# Altium project DVT-SPI_Buffer.PrjPcb (part 2 of 2)
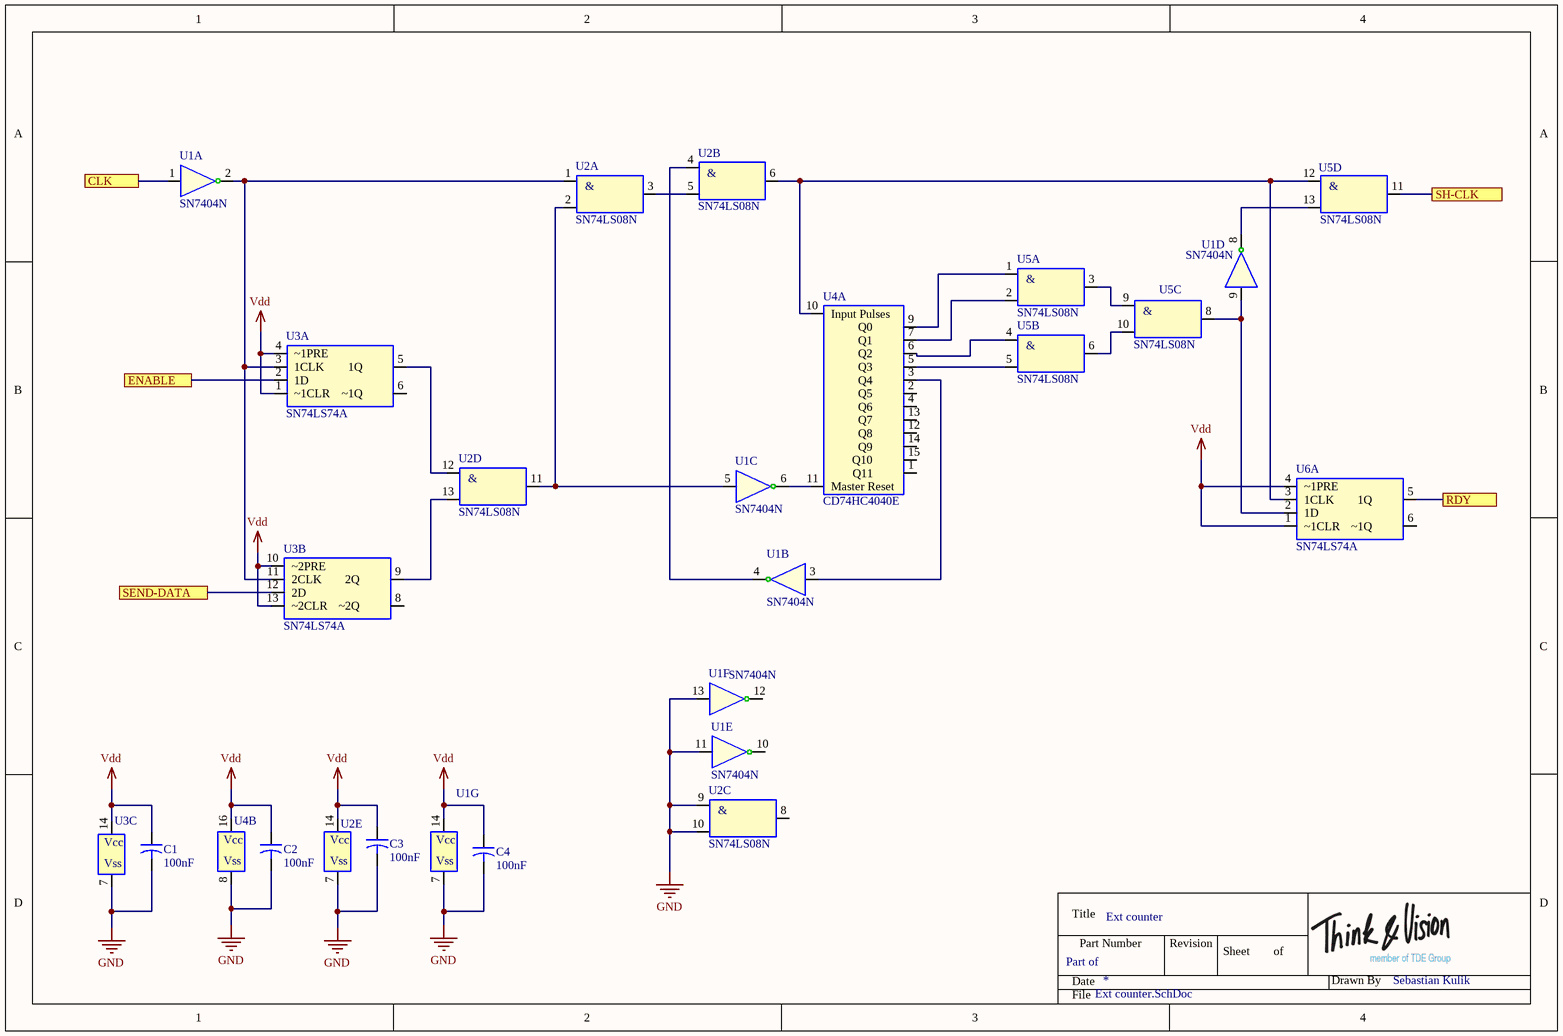
[diagram p7: Ext counter.SchDoc]

## Nets that join several sheets
GND: SPI Counter (7 pins), J-K-Flip-Flop (21 pins), Universal register 16bit/Universal Register 4Bit (U1_Universal_register_16bit_Universal_Register_4Bit#1.7 U2_Universal_register_16bit_Universal_Register_4Bit#1.7), Universal register 16bit/Universal Register 4Bit/Quad 2x1 mux (8 pins), Universal register 16bit/Quad 2x1 mux (8 pins), Universal register 16bit/Universal Register 4Bit (U1_Universal_register_16bit_Universal_Register_4Bit#2.7 U2_Universal_register_16bit_Universal_Register_4Bit#2.7), Universal register 16bit/Universal Register 4Bit/Quad 2x1 mux (8 pins), Universal register 16bit/Universal Register 4Bit (U1_Universal_register_16bit_Universal_Register_4Bit#3.7 U2_Universal_register_16bit_Universal_Register_4Bit#3.7), Universal register 16bit/Universal Register 4Bit/Quad 2x1 mux (8 pins), Universal register 16bit/Universal Register 4Bit (U1_Universal_register_16bit_Universal_Register_4Bit#4.7 U2_Universal_register_16bit_Universal_Register_4Bit#4.7), Universal register 16bit/Universal Register 4Bit/Quad 2x1 mux (8 pins), Ext counter (12 pins), Universal register 16bit/Universal Register 4Bit (U1_Universal_register_16bit_Universal_Register_4Bit#5.7 U2_Universal_register_16bit_Universal_Register_4Bit#5.7), Universal register 16bit/Universal Register 4Bit/Quad 2x1 mux (8 pins), Universal register 16bit/Quad 2x1 mux (8 pins), Universal register 16bit/Universal Register 4Bit (U1_Universal_register_16bit_Universal_Register_4Bit#6.7 U2_Universal_register_16bit_Universal_Register_4Bit#6.7), Universal register 16bit/Universal Register 4Bit/Quad 2x1 mux (8 pins), Universal register 16bit/Universal Register 4Bit (U1_Universal_register_16bit_Universal_Register_4Bit#7.7 U2_Universal_register_16bit_Universal_Register_4Bit#7.7), Universal register 16bit/Universal Register 4Bit/Quad 2x1 mux (8 pins), Universal register 16bit/Universal Register 4Bit (U1_Universal_register_16bit_Universal_Register_4Bit#8.7 U2_Universal_register_16bit_Universal_Register_4Bit#8.7), Universal register 16bit/Universal Register 4Bit/Quad 2x1 mux (8 pins)
Vdd: SPI Counter (11 pins), J-K-Flip-Flop (11 pins), Universal register 16bit/Universal Register 4Bit (10 pins), Universal register 16bit/Universal Register 4Bit/Quad 2x1 mux (16 pins), Universal register 16bit/Quad 2x1 mux (16 pins), Universal register 16bit/Universal Register 4Bit (10 pins), Universal register 16bit/Universal Register 4Bit/Quad 2x1 mux (16 pins), Universal register 16bit/Universal Register 4Bit (10 pins), Universal register 16bit/Universal Register 4Bit/Quad 2x1 mux (16 pins), Universal register 16bit/Universal Register 4Bit (10 pins), Universal register 16bit/Universal Register 4Bit/Quad 2x1 mux (16 pins), Ext counter (14 pins), Universal register 16bit/Universal Register 4Bit (10 pins), Universal register 16bit/Universal Register 4Bit/Quad 2x1 mux (8 pins), Universal register 16bit/Quad 2x1 mux (8 pins), Universal register 16bit/Universal Register 4Bit (10 pins), Universal register 16bit/Universal Register 4Bit/Quad 2x1 mux (8 pins), Universal register 16bit/Universal Register 4Bit (10 pins), Universal register 16bit/Universal Register 4Bit/Quad 2x1 mux (8 pins), Universal register 16bit/Universal Register 4Bit (10 pins), Universal register 16bit/Universal Register 4Bit/Quad 2x1 mux (8 pins)
NetCLK-DELAY_1: SPI Counter (U1#2.2), J-K-Flip-Flop (CLK-DELAY.1 U1#3.1)
NetU1#1_3: DVT SPI buffer (U1#1.3), SPI Counter (U6#1.12)
NetU1#2_5: DVT SPI buffer (U2#1.1), SPI Counter (U1#2.5 U3#2.1)
NetU1#2_11: SPI Counter (U1#2.11 U5#1.3 U6#1.6), Universal register 16bit/Quad 2x1 mux (U2_Universal_register_16bit_Quad_2x1_mux#2.5)
NetU1#3_11: SPI Counter (U5#1.5 U7.2), J-K-Flip-Flop (U1#3.11)
NetU1_Universal_register_16bit_Quad_2x1_mux#2_1: SPI Counter (U6#1.5), J-K-Flip-Flop (U2#3.10 U3#3.5), Universal register 16bit/Universal Register 4Bit/Quad 2x1 mux (8 pins), Universal register 16bit/Quad 2x1 mux (8 pins), Universal register 16bit/Universal Register 4Bit/Quad 2x1 mux (8 pins), Universal register 16bit/Universal Register 4Bit/Quad 2x1 mux (8 pins), Universal register 16bit/Universal Register 4Bit/Quad 2x1 mux (8 pins)
NetU1_Universal_register_16bit_Universal_Register_4Bit#1_2: Universal register 16bit/Universal Register 4Bit (U1_Universal_register_16bit_Universal_Register_4Bit#1.2), Universal register 16bit/Universal Register 4Bit/Quad 2x1 mux (U4_Universal_register_16bit_Universal_Register_4Bit_Quad_2x1_mux#1.3)
NetU1_Universal_register_16bit_Universal_Register_4Bit#1_3: Universal register 16bit/Universal Register 4Bit (U1_Universal_register_16bit_Universal_Register_4Bit#1.3 U1_Universal_register_16bit_Universal_Register_4Bit#1.11 U2_Universal_register_16bit_Universal_Register_4Bit#1.3 U2_Universal_register_16bit_Universal_Register_4Bit#1.11), Universal register 16bit/Quad 2x1 mux (U4_Universal_register_16bit_Quad_2x1_mux#1.3), Universal register 16bit/Universal Register 4Bit (U1_Universal_register_16bit_Universal_Register_4Bit#2.3 U1_Universal_register_16bit_Universal_Register_4Bit#2.11 U2_Universal_register_16bit_Universal_Register_4Bit#2.3 U2_Universal_register_16bit_Universal_Register_4Bit#2.11), Universal register 16bit/Universal Register 4Bit (U1_Universal_register_16bit_Universal_Register_4Bit#3.3 U1_Universal_register_16bit_Universal_Register_4Bit#3.11 U2_Universal_register_16bit_Universal_Register_4Bit#3.3 U2_Universal_register_16bit_Universal_Register_4Bit#3.11), Universal register 16bit/Universal Register 4Bit (U1_Universal_register_16bit_Universal_Register_4Bit#4.3 U1_Universal_register_16bit_Universal_Register_4Bit#4.11 U2_Universal_register_16bit_Universal_Register_4Bit#4.3 U2_Universal_register_16bit_Universal_Register_4Bit#4.11)
NetU1_Universal_register_16bit_Universal_Register_4Bit#1_5: Universal register 16bit/Universal Register 4Bit (U1_Universal_register_16bit_Universal_Register_4Bit#1.5), Universal register 16bit/Universal Register 4Bit/Quad 2x1 mux (U2_Universal_register_16bit_Universal_Register_4Bit_Quad_2x1_mux#1.9), Universal register 16bit/Universal Register 4Bit/Quad 2x1 mux (U2_Universal_register_16bit_Universal_Register_4Bit_Quad_2x1_mux#5.5)
NetU1_Universal_register_16bit_Universal_Register_4Bit#1_9: Universal register 16bit/Universal Register 4Bit (U1_Universal_register_16bit_Universal_Register_4Bit#1.9), Universal register 16bit/Universal Register 4Bit/Quad 2x1 mux (U3_Universal_register_16bit_Universal_Register_4Bit_Quad_2x1_mux#1.1), Universal register 16bit/Universal Register 4Bit/Quad 2x1 mux (U2_Universal_register_16bit_Universal_Register_4Bit_Quad_2x1_mux#5.13)
NetU1_Universal_register_16bit_Universal_Register_4Bit#1_12: Universal register 16bit/Universal Register 4Bit (U1_Universal_register_16bit_Universal_Register_4Bit#1.12), Universal register 16bit/Universal Register 4Bit/Quad 2x1 mux (U4_Universal_register_16bit_Universal_Register_4Bit_Quad_2x1_mux#1.6)
NetU1_Universal_register_16bit_Universal_Register_4Bit#2_2: Universal register 16bit/Universal Register 4Bit (U1_Universal_register_16bit_Universal_Register_4Bit#2.2), Universal register 16bit/Universal Register 4Bit/Quad 2x1 mux (U4_Universal_register_16bit_Universal_Register_4Bit_Quad_2x1_mux#2.3)
NetU1_Universal_register_16bit_Universal_Register_4Bit#2_5: Universal register 16bit/Universal Register 4Bit (U1_Universal_register_16bit_Universal_Register_4Bit#2.5), Universal register 16bit/Universal Register 4Bit/Quad 2x1 mux (U2_Universal_register_16bit_Universal_Register_4Bit_Quad_2x1_mux#2.9), Universal register 16bit/Universal Register 4Bit/Quad 2x1 mux (U2_Universal_register_16bit_Universal_Register_4Bit_Quad_2x1_mux#6.5)
NetU1_Universal_register_16bit_Universal_Register_4Bit#2_9: Universal register 16bit/Universal Register 4Bit (U1_Universal_register_16bit_Universal_Register_4Bit#2.9), Universal register 16bit/Universal Register 4Bit/Quad 2x1 mux (U3_Universal_register_16bit_Universal_Register_4Bit_Quad_2x1_mux#2.1), Universal register 16bit/Universal Register 4Bit/Quad 2x1 mux (U2_Universal_register_16bit_Universal_Register_4Bit_Quad_2x1_mux#6.13)
NetU1_Universal_register_16bit_Universal_Register_4Bit#2_12: Universal register 16bit/Universal Register 4Bit (U1_Universal_register_16bit_Universal_Register_4Bit#2.12), Universal register 16bit/Universal Register 4Bit/Quad 2x1 mux (U4_Universal_register_16bit_Universal_Register_4Bit_Quad_2x1_mux#2.6)
NetU1_Universal_register_16bit_Universal_Register_4Bit#3_2: Universal register 16bit/Universal Register 4Bit (U1_Universal_register_16bit_Universal_Register_4Bit#3.2), Universal register 16bit/Universal Register 4Bit/Quad 2x1 mux (U4_Universal_register_16bit_Universal_Register_4Bit_Quad_2x1_mux#3.3)
NetU1_Universal_register_16bit_Universal_Register_4Bit#3_5: Universal register 16bit/Universal Register 4Bit (U1_Universal_register_16bit_Universal_Register_4Bit#3.5), Universal register 16bit/Universal Register 4Bit/Quad 2x1 mux (U2_Universal_register_16bit_Universal_Register_4Bit_Quad_2x1_mux#3.9), Universal register 16bit/Universal Register 4Bit/Quad 2x1 mux (U2_Universal_register_16bit_Universal_Register_4Bit_Quad_2x1_mux#7.5)
NetU1_Universal_register_16bit_Universal_Register_4Bit#3_9: Universal register 16bit/Universal Register 4Bit (U1_Universal_register_16bit_Universal_Register_4Bit#3.9), Universal register 16bit/Universal Register 4Bit/Quad 2x1 mux (U3_Universal_register_16bit_Universal_Register_4Bit_Quad_2x1_mux#3.1), Universal register 16bit/Universal Register 4Bit/Quad 2x1 mux (U2_Universal_register_16bit_Universal_Register_4Bit_Quad_2x1_mux#7.13)
NetU1_Universal_register_16bit_Universal_Register_4Bit#3_12: Universal register 16bit/Universal Register 4Bit (U1_Universal_register_16bit_Universal_Register_4Bit#3.12), Universal register 16bit/Universal Register 4Bit/Quad 2x1 mux (U4_Universal_register_16bit_Universal_Register_4Bit_Quad_2x1_mux#3.6)
NetU1_Universal_register_16bit_Universal_Register_4Bit#4_2: Universal register 16bit/Universal Register 4Bit (U1_Universal_register_16bit_Universal_Register_4Bit#4.2), Universal register 16bit/Universal Register 4Bit/Quad 2x1 mux (U4_Universal_register_16bit_Universal_Register_4Bit_Quad_2x1_mux#4.3)
NetU1_Universal_register_16bit_Universal_Register_4Bit#4_5: Universal register 16bit/Universal Register 4Bit (U1_Universal_register_16bit_Universal_Register_4Bit#4.5), Universal register 16bit/Universal Register 4Bit/Quad 2x1 mux (U2_Universal_register_16bit_Universal_Register_4Bit_Quad_2x1_mux#4.9), Universal register 16bit/Universal Register 4Bit/Quad 2x1 mux (U2_Universal_register_16bit_Universal_Register_4Bit_Quad_2x1_mux#8.5)
NetU1_Universal_register_16bit_Universal_Register_4Bit#4_9: Universal register 16bit/Universal Register 4Bit (U1_Universal_register_16bit_Universal_Register_4Bit#4.9), Universal register 16bit/Universal Register 4Bit/Quad 2x1 mux (U3_Universal_register_16bit_Universal_Register_4Bit_Quad_2x1_mux#4.1), Universal register 16bit/Universal Register 4Bit/Quad 2x1 mux (U2_Universal_register_16bit_Universal_Register_4Bit_Quad_2x1_mux#8.13)
NetU1_Universal_register_16bit_Universal_Register_4Bit#4_12: Universal register 16bit/Universal Register 4Bit (U1_Universal_register_16bit_Universal_Register_4Bit#4.12), Universal register 16bit/Universal Register 4Bit/Quad 2x1 mux (U4_Universal_register_16bit_Universal_Register_4Bit_Quad_2x1_mux#4.6)
NetU1_Universal_register_16bit_Universal_Register_4Bit#5_2: Universal register 16bit/Universal Register 4Bit (U1_Universal_register_16bit_Universal_Register_4Bit#5.2), Universal register 16bit/Universal Register 4Bit/Quad 2x1 mux (U4_Universal_register_16bit_Universal_Register_4Bit_Quad_2x1_mux#5.3)
NetU1_Universal_register_16bit_Universal_Register_4Bit#5_3: Universal register 16bit/Universal Register 4Bit (U1_Universal_register_16bit_Universal_Register_4Bit#5.3 U1_Universal_register_16bit_Universal_Register_4Bit#5.11 U2_Universal_register_16bit_Universal_Register_4Bit#5.3 U2_Universal_register_16bit_Universal_Register_4Bit#5.11), Universal register 16bit/Quad 2x1 mux (U4_Universal_register_16bit_Quad_2x1_mux#2.3), Universal register 16bit/Universal Register 4Bit (U1_Universal_register_16bit_Universal_Register_4Bit#6.3 U1_Universal_register_16bit_Universal_Register_4Bit#6.11 U2_Universal_register_16bit_Universal_Register_4Bit#6.3 U2_Universal_register_16bit_Universal_Register_4Bit#6.11), Universal register 16bit/Universal Register 4Bit (U1_Universal_register_16bit_Universal_Register_4Bit#7.3 U1_Universal_register_16bit_Universal_Register_4Bit#7.11 U2_Universal_register_16bit_Universal_Register_4Bit#7.3 U2_Universal_register_16bit_Universal_Register_4Bit#7.11), Universal register 16bit/Universal Register 4Bit (U1_Universal_register_16bit_Universal_Register_4Bit#8.3 U1_Universal_register_16bit_Universal_Register_4Bit#8.11 U2_Universal_register_16bit_Universal_Register_4Bit#8.3 U2_Universal_register_16bit_Universal_Register_4Bit#8.11)
NetU1_Universal_register_16bit_Universal_Register_4Bit#5_5: Universal register 16bit/Universal Register 4Bit (U1_Universal_register_16bit_Universal_Register_4Bit#5.5), Universal register 16bit/Universal Register 4Bit/Quad 2x1 mux (U2_Universal_register_16bit_Universal_Register_4Bit_Quad_2x1_mux#5.9)
NetU1_Universal_register_16bit_Universal_Register_4Bit#5_9: Universal register 16bit/Universal Register 4Bit (U1_Universal_register_16bit_Universal_Register_4Bit#5.9), Universal register 16bit/Universal Register 4Bit/Quad 2x1 mux (U3_Universal_register_16bit_Universal_Register_4Bit_Quad_2x1_mux#5.1)
NetU1_Universal_register_16bit_Universal_Register_4Bit#5_12: Universal register 16bit/Universal Register 4Bit (U1_Universal_register_16bit_Universal_Register_4Bit#5.12), Universal register 16bit/Universal Register 4Bit/Quad 2x1 mux (U4_Universal_register_16bit_Universal_Register_4Bit_Quad_2x1_mux#5.6)
NetU1_Universal_register_16bit_Universal_Register_4Bit#6_2: Universal register 16bit/Universal Register 4Bit (U1_Universal_register_16bit_Universal_Register_4Bit#6.2), Universal register 16bit/Universal Register 4Bit/Quad 2x1 mux (U4_Universal_register_16bit_Universal_Register_4Bit_Quad_2x1_mux#6.3)
NetU1_Universal_register_16bit_Universal_Register_4Bit#6_5: Universal register 16bit/Universal Register 4Bit (U1_Universal_register_16bit_Universal_Register_4Bit#6.5), Universal register 16bit/Universal Register 4Bit/Quad 2x1 mux (U2_Universal_register_16bit_Universal_Register_4Bit_Quad_2x1_mux#6.9)
NetU1_Universal_register_16bit_Universal_Register_4Bit#6_9: Universal register 16bit/Universal Register 4Bit (U1_Universal_register_16bit_Universal_Register_4Bit#6.9), Universal register 16bit/Universal Register 4Bit/Quad 2x1 mux (U3_Universal_register_16bit_Universal_Register_4Bit_Quad_2x1_mux#6.1)
NetU1_Universal_register_16bit_Universal_Register_4Bit#6_12: Universal register 16bit/Universal Register 4Bit (U1_Universal_register_16bit_Universal_Register_4Bit#6.12), Universal register 16bit/Universal Register 4Bit/Quad 2x1 mux (U4_Universal_register_16bit_Universal_Register_4Bit_Quad_2x1_mux#6.6)
NetU1_Universal_register_16bit_Universal_Register_4Bit#7_2: Universal register 16bit/Universal Register 4Bit (U1_Universal_register_16bit_Universal_Register_4Bit#7.2), Universal register 16bit/Universal Register 4Bit/Quad 2x1 mux (U4_Universal_register_16bit_Universal_Register_4Bit_Quad_2x1_mux#7.3)
NetU1_Universal_register_16bit_Universal_Register_4Bit#7_5: Universal register 16bit/Universal Register 4Bit (U1_Universal_register_16bit_Universal_Register_4Bit#7.5), Universal register 16bit/Universal Register 4Bit/Quad 2x1 mux (U2_Universal_register_16bit_Universal_Register_4Bit_Quad_2x1_mux#7.9)
NetU1_Universal_register_16bit_Universal_Register_4Bit#7_9: Universal register 16bit/Universal Register 4Bit (U1_Universal_register_16bit_Universal_Register_4Bit#7.9), Universal register 16bit/Universal Register 4Bit/Quad 2x1 mux (U3_Universal_register_16bit_Universal_Register_4Bit_Quad_2x1_mux#7.1)
NetU1_Universal_register_16bit_Universal_Register_4Bit#7_12: Universal register 16bit/Universal Register 4Bit (U1_Universal_register_16bit_Universal_Register_4Bit#7.12), Universal register 16bit/Universal Register 4Bit/Quad 2x1 mux (U4_Universal_register_16bit_Universal_Register_4Bit_Quad_2x1_mux#7.6)
NetU1_Universal_register_16bit_Universal_Register_4Bit#8_2: Universal register 16bit/Universal Register 4Bit (U1_Universal_register_16bit_Universal_Register_4Bit#8.2), Universal register 16bit/Universal Register 4Bit/Quad 2x1 mux (U4_Universal_register_16bit_Universal_Register_4Bit_Quad_2x1_mux#8.3)
NetU1_Universal_register_16bit_Universal_Register_4Bit#8_5: Universal register 16bit/Universal Register 4Bit (U1_Universal_register_16bit_Universal_Register_4Bit#8.5), Universal register 16bit/Universal Register 4Bit/Quad 2x1 mux (U2_Universal_register_16bit_Universal_Register_4Bit_Quad_2x1_mux#8.9)
NetU1_Universal_register_16bit_Universal_Register_4Bit#8_9: Universal register 16bit/Universal Register 4Bit (U1_Universal_register_16bit_Universal_Register_4Bit#8.9), Universal register 16bit/Universal Register 4Bit/Quad 2x1 mux (U3_Universal_register_16bit_Universal_Register_4Bit_Quad_2x1_mux#8.1)
NetU1_Universal_register_16bit_Universal_Register_4Bit#8_12: Universal register 16bit/Universal Register 4Bit (U1_Universal_register_16bit_Universal_Register_4Bit#8.12), Universal register 16bit/Universal Register 4Bit/Quad 2x1 mux (U4_Universal_register_16bit_Universal_Register_4Bit_Quad_2x1_mux#8.6)
NetU2#2_11: SPI Counter (U2#2.11), Universal register 16bit/Quad 2x1 mux (U2_Universal_register_16bit_Quad_2x1_mux#1.1)
NetU2#3_1: SPI Counter (U7.3), J-K-Flip-Flop (U2#3.1)
NetU2_Universal_register_16bit_Quad_2x1_mux#2_1: Ext counter (U5#2.11), Universal register 16bit/Quad 2x1 mux (U2_Universal_register_16bit_Quad_2x1_mux#2.1)
NetU2_Universal_register_16bit_Universal_Register_4Bit#1_2: Universal register 16bit/Universal Register 4Bit (U2_Universal_register_16bit_Universal_Register_4Bit#1.2), Universal register 16bit/Universal Register 4Bit/Quad 2x1 mux (U4_Universal_register_16bit_Universal_Register_4Bit_Quad_2x1_mux#1.8)
NetU2_Universal_register_16bit_Universal_Register_4Bit#1_5: Universal register 16bit/Universal Register 4Bit (U2_Universal_register_16bit_Universal_Register_4Bit#1.5), Universal register 16bit/Universal Register 4Bit/Quad 2x1 mux (U3_Universal_register_16bit_Universal_Register_4Bit_Quad_2x1_mux#1.9), Universal register 16bit/Universal Register 4Bit/Quad 2x1 mux (U3_Universal_register_16bit_Universal_Register_4Bit_Quad_2x1_mux#5.5)
NetU2_Universal_register_16bit_Universal_Register_4Bit#1_9: Universal register 16bit/Universal Register 4Bit (U2_Universal_register_16bit_Universal_Register_4Bit#1.9), Universal register 16bit/Universal Register 4Bit/Quad 2x1 mux (U2_Universal_register_16bit_Universal_Register_4Bit_Quad_2x1_mux#2.1), Universal register 16bit/Universal Register 4Bit/Quad 2x1 mux (U3_Universal_register_16bit_Universal_Register_4Bit_Quad_2x1_mux#5.13)
NetU2_Universal_register_16bit_Universal_Register_4Bit#1_12: Universal register 16bit/Universal Register 4Bit (U2_Universal_register_16bit_Universal_Register_4Bit#1.12), Universal register 16bit/Universal Register 4Bit/Quad 2x1 mux (U4_Universal_register_16bit_Universal_Register_4Bit_Quad_2x1_mux#1.11)
NetU2_Universal_register_16bit_Universal_Register_4Bit#2_2: Universal register 16bit/Universal Register 4Bit (U2_Universal_register_16bit_Universal_Register_4Bit#2.2), Universal register 16bit/Universal Register 4Bit/Quad 2x1 mux (U4_Universal_register_16bit_Universal_Register_4Bit_Quad_2x1_mux#2.8)
NetU2_Universal_register_16bit_Universal_Register_4Bit#2_5: Universal register 16bit/Universal Register 4Bit (U2_Universal_register_16bit_Universal_Register_4Bit#2.5), Universal register 16bit/Universal Register 4Bit/Quad 2x1 mux (U3_Universal_register_16bit_Universal_Register_4Bit_Quad_2x1_mux#2.9), Universal register 16bit/Universal Register 4Bit/Quad 2x1 mux (U3_Universal_register_16bit_Universal_Register_4Bit_Quad_2x1_mux#6.5)
NetU2_Universal_register_16bit_Universal_Register_4Bit#2_9: Universal register 16bit/Universal Register 4Bit (U2_Universal_register_16bit_Universal_Register_4Bit#2.9), Universal register 16bit/Universal Register 4Bit/Quad 2x1 mux (U2_Universal_register_16bit_Universal_Register_4Bit_Quad_2x1_mux#3.1), Universal register 16bit/Universal Register 4Bit/Quad 2x1 mux (U3_Universal_register_16bit_Universal_Register_4Bit_Quad_2x1_mux#6.13)
NetU2_Universal_register_16bit_Universal_Register_4Bit#2_12: Universal register 16bit/Universal Register 4Bit (U2_Universal_register_16bit_Universal_Register_4Bit#2.12), Universal register 16bit/Universal Register 4Bit/Quad 2x1 mux (U4_Universal_register_16bit_Universal_Register_4Bit_Quad_2x1_mux#2.11)
NetU2_Universal_register_16bit_Universal_Register_4Bit#3_2: Universal register 16bit/Universal Register 4Bit (U2_Universal_register_16bit_Universal_Register_4Bit#3.2), Universal register 16bit/Universal Register 4Bit/Quad 2x1 mux (U4_Universal_register_16bit_Universal_Register_4Bit_Quad_2x1_mux#3.8)
NetU2_Universal_register_16bit_Universal_Register_4Bit#3_5: Universal register 16bit/Universal Register 4Bit (U2_Universal_register_16bit_Universal_Register_4Bit#3.5), Universal register 16bit/Universal Register 4Bit/Quad 2x1 mux (U3_Universal_register_16bit_Universal_Register_4Bit_Quad_2x1_mux#3.9), Universal register 16bit/Universal Register 4Bit/Quad 2x1 mux (U3_Universal_register_16bit_Universal_Register_4Bit_Quad_2x1_mux#7.5)
NetU2_Universal_register_16bit_Universal_Register_4Bit#3_9: Universal register 16bit/Universal Register 4Bit (U2_Universal_register_16bit_Universal_Register_4Bit#3.9), Universal register 16bit/Universal Register 4Bit/Quad 2x1 mux (U2_Universal_register_16bit_Universal_Register_4Bit_Quad_2x1_mux#4.1), Universal register 16bit/Universal Register 4Bit/Quad 2x1 mux (U3_Universal_register_16bit_Universal_Register_4Bit_Quad_2x1_mux#7.13)
NetU2_Universal_register_16bit_Universal_Register_4Bit#3_12: Universal register 16bit/Universal Register 4Bit (U2_Universal_register_16bit_Universal_Register_4Bit#3.12), Universal register 16bit/Universal Register 4Bit/Quad 2x1 mux (U4_Universal_register_16bit_Universal_Register_4Bit_Quad_2x1_mux#3.11)
NetU2_Universal_register_16bit_Universal_Register_4Bit#4_2: Universal register 16bit/Universal Register 4Bit (U2_Universal_register_16bit_Universal_Register_4Bit#4.2), Universal register 16bit/Universal Register 4Bit/Quad 2x1 mux (U4_Universal_register_16bit_Universal_Register_4Bit_Quad_2x1_mux#4.8)
NetU2_Universal_register_16bit_Universal_Register_4Bit#4_5: Universal register 16bit/Universal Register 4Bit (U2_Universal_register_16bit_Universal_Register_4Bit#4.5), Universal register 16bit/Universal Register 4Bit/Quad 2x1 mux (U3_Universal_register_16bit_Universal_Register_4Bit_Quad_2x1_mux#4.9), Universal register 16bit/Universal Register 4Bit/Quad 2x1 mux (U3_Universal_register_16bit_Universal_Register_4Bit_Quad_2x1_mux#8.5)
NetU2_Universal_register_16bit_Universal_Register_4Bit#4_9: Universal register 16bit/Universal Register 4Bit (U2_Universal_register_16bit_Universal_Register_4Bit#4.9), Universal register 16bit/Universal Register 4Bit/Quad 2x1 mux (U3_Universal_register_16bit_Universal_Register_4Bit_Quad_2x1_mux#8.13)
NetU2_Universal_register_16bit_Universal_Register_4Bit#4_12: Universal register 16bit/Universal Register 4Bit (U2_Universal_register_16bit_Universal_Register_4Bit#4.12), Universal register 16bit/Universal Register 4Bit/Quad 2x1 mux (U4_Universal_register_16bit_Universal_Register_4Bit_Quad_2x1_mux#4.11)
NetU2_Universal_register_16bit_Universal_Register_4Bit#5_2: Universal register 16bit/Universal Register 4Bit (U2_Universal_register_16bit_Universal_Register_4Bit#5.2), Universal register 16bit/Universal Register 4Bit/Quad 2x1 mux (U4_Universal_register_16bit_Universal_Register_4Bit_Quad_2x1_mux#5.8)
NetU2_Universal_register_16bit_Universal_Register_4Bit#5_5: Universal register 16bit/Universal Register 4Bit (U2_Universal_register_16bit_Universal_Register_4Bit#5.5), Universal register 16bit/Universal Register 4Bit/Quad 2x1 mux (U3_Universal_register_16bit_Universal_Register_4Bit_Quad_2x1_mux#5.9)
NetU2_Universal_register_16bit_Universal_Register_4Bit#5_9: Universal register 16bit/Universal Register 4Bit (U2_Universal_register_16bit_Universal_Register_4Bit#5.9), Universal register 16bit/Universal Register 4Bit/Quad 2x1 mux (U2_Universal_register_16bit_Universal_Register_4Bit_Quad_2x1_mux#6.1)
NetU2_Universal_register_16bit_Universal_Register_4Bit#5_12: Universal register 16bit/Universal Register 4Bit (U2_Universal_register_16bit_Universal_Register_4Bit#5.12), Universal register 16bit/Universal Register 4Bit/Quad 2x1 mux (U4_Universal_register_16bit_Universal_Register_4Bit_Quad_2x1_mux#5.11)
NetU2_Universal_register_16bit_Universal_Register_4Bit#6_2: Universal register 16bit/Universal Register 4Bit (U2_Universal_register_16bit_Universal_Register_4Bit#6.2), Universal register 16bit/Universal Register 4Bit/Quad 2x1 mux (U4_Universal_register_16bit_Universal_Register_4Bit_Quad_2x1_mux#6.8)
NetU2_Universal_register_16bit_Universal_Register_4Bit#6_5: Universal register 16bit/Universal Register 4Bit (U2_Universal_register_16bit_Universal_Register_4Bit#6.5), Universal register 16bit/Universal Register 4Bit/Quad 2x1 mux (U3_Universal_register_16bit_Universal_Register_4Bit_Quad_2x1_mux#6.9)
NetU2_Universal_register_16bit_Universal_Register_4Bit#6_9: Universal register 16bit/Universal Register 4Bit (U2_Universal_register_16bit_Universal_Register_4Bit#6.9), Universal register 16bit/Universal Register 4Bit/Quad 2x1 mux (U2_Universal_register_16bit_Universal_Register_4Bit_Quad_2x1_mux#7.1)
NetU2_Universal_register_16bit_Universal_Register_4Bit#6_12: Universal register 16bit/Universal Register 4Bit (U2_Universal_register_16bit_Universal_Register_4Bit#6.12), Universal register 16bit/Universal Register 4Bit/Quad 2x1 mux (U4_Universal_register_16bit_Universal_Register_4Bit_Quad_2x1_mux#6.11)
NetU2_Universal_register_16bit_Universal_Register_4Bit#7_2: Universal register 16bit/Universal Register 4Bit (U2_Universal_register_16bit_Universal_Register_4Bit#7.2), Universal register 16bit/Universal Register 4Bit/Quad 2x1 mux (U4_Universal_register_16bit_Universal_Register_4Bit_Quad_2x1_mux#7.8)
NetU2_Universal_register_16bit_Universal_Register_4Bit#7_5: Universal register 16bit/Universal Register 4Bit (U2_Universal_register_16bit_Universal_Register_4Bit#7.5), Universal register 16bit/Universal Register 4Bit/Quad 2x1 mux (U3_Universal_register_16bit_Universal_Register_4Bit_Quad_2x1_mux#7.9)
NetU2_Universal_register_16bit_Universal_Register_4Bit#7_9: Universal register 16bit/Universal Register 4Bit (U2_Universal_register_16bit_Universal_Register_4Bit#7.9), Universal register 16bit/Universal Register 4Bit/Quad 2x1 mux (U2_Universal_register_16bit_Universal_Register_4Bit_Quad_2x1_mux#8.1)
NetU2_Universal_register_16bit_Universal_Register_4Bit#7_12: Universal register 16bit/Universal Register 4Bit (U2_Universal_register_16bit_Universal_Register_4Bit#7.12), Universal register 16bit/Universal Register 4Bit/Quad 2x1 mux (U4_Universal_register_16bit_Universal_Register_4Bit_Quad_2x1_mux#7.11)
NetU2_Universal_register_16bit_Universal_Register_4Bit#8_2: Universal register 16bit/Universal Register 4Bit (U2_Universal_register_16bit_Universal_Register_4Bit#8.2), Universal register 16bit/Universal Register 4Bit/Quad 2x1 mux (U4_Universal_register_16bit_Universal_Register_4Bit_Quad_2x1_mux#8.8)
NetU2_Universal_register_16bit_Universal_Register_4Bit#8_5: Universal register 16bit/Universal Register 4Bit (U2_Universal_register_16bit_Universal_Register_4Bit#8.5), Universal register 16bit/Universal Register 4Bit/Quad 2x1 mux (U3_Universal_register_16bit_Universal_Register_4Bit_Quad_2x1_mux#8.9)
NetU2_Universal_register_16bit_Universal_Register_4Bit#8_12: Universal register 16bit/Universal Register 4Bit (U2_Universal_register_16bit_Universal_Register_4Bit#8.12), Universal register 16bit/Universal Register 4Bit/Quad 2x1 mux (U4_Universal_register_16bit_Universal_Register_4Bit_Quad_2x1_mux#8.11)